# Altium schematic sheet main_board.SchDoc
size A4; SheetNumber: 1; SheetTotal: 1
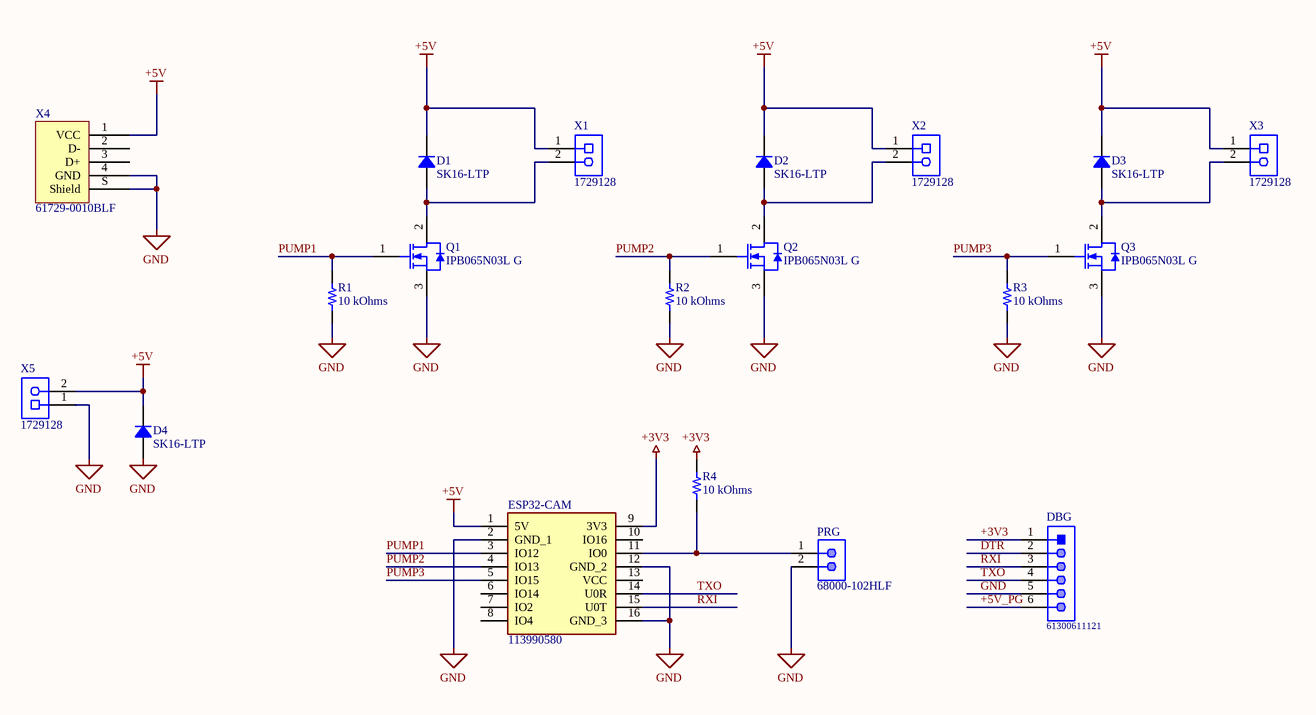
[diagram p0: main_board.SchDoc]

## Parts
D1  SK16-LTP  [DO214AA SMB]
D2  SK16-LTP  [DO214AA SMB]
D3  SK16-LTP  [DO214AA SMB]
D4  SK16-LTP  [DO214AA SMB]
DBG  61300611121  [61300611121]
ESP32-CAM  113990580  [113990580]
PRG  68000-102HLF  [AMPH-68000-102HLF_V]
Q1  IPB065N03L G  [INF-PG-TO-263-3-2_A_L]
Q2  IPB065N03L G  [INF-PG-TO-263-3-2_A_L]
Q3  IPB065N03L G  [INF-PG-TO-263-3-2_A_L]
R1  10 kOhms  [RES 1206_3216]
R2  10 kOhms  [RES 1206_3216]
R3  10 kOhms  [RES 1206_3216]
R4  10 kOhms  [RES 1206_3216]
X1  1729128  [PHOE-1729128-2_V]
X2  1729128  [PHOE-1729128-2_V]
X3  1729128  [PHOE-1729128-2_V]
X4  61729-0010BLF  [FCI USB 61729-0010BLF]
X5  1729128  [PHOE-1729128-2_V]

## Nets
+3V3: DBG.1 ESP32-CAM.9(3V3) R4.1
+5V: D1.2 D2.2 D3.2 D4.2 ESP32-CAM.1(5V) X1.1 X2.1 X3.1 X4.1(VCC) X5.2
GND: D4.1 DBG.5 ESP32-CAM.2(GND_1) ESP32-CAM.12(GND_2) ESP32-CAM.16(GND_3) PRG.2 Q1.3(SOURCE) Q2.3(SOURCE) Q3.3(SOURCE) R1.2 R2.2 R3.2 X4.4(GND) X4.S(Shield) X5.1
+5V_PG: DBG.6
DTR: DBG.2
PUMP1: ESP32-CAM.3(IO12) Q1.1(GATE) R1.1
PUMP2: ESP32-CAM.4(IO13) Q2.1(GATE) R2.1
PUMP3: ESP32-CAM.5(IO15) Q3.1(GATE) R3.1
RXI: DBG.3 ESP32-CAM.15(U0T)
TXO: DBG.4 ESP32-CAM.14(U0R)
NetD1_1: D1.1 Q1.2(DRAIN) X1.2
NetD2_1: D2.1 Q2.2(DRAIN) X2.2
NetD3_1: D3.1 Q3.2(DRAIN) X3.2
NetESP32-CAM_11: ESP32-CAM.11(IO0) PRG.1 R4.2

Not connected (* = marked no-connect by the designer): ESP32-CAM 6(IO14) 7(IO2) 8(IO4) 10(IO16) 13(VCC); X4 2(D-) 3(D+)

## Library data of the parts
D1-D4 = SK16-LTP: DIODE SCHOTTKY 60V 1A DO214AA; Manufacturer: Micro Commercial Co; Current - Reverse Leakage @ Vr: 500µA @ 60V; Speed: Fast Recovery =< 500ns, > 200mA (Io); Voltage - Forward (Vf) (Max) @ If: 720mV @ 1A; Part Number: SK16-LTP; ComponentLink1Description: Datasheet; ComponentLink1URL: https://www.mccsemi.com/pdf/Products/SK12-L~SK110-L(DO-214AA)-V1.pdf; ComponentLink2Description: DigiKey Link; ComponentLink2URL: http://digikey.com/product-detail/en/micro-commercial-co/SK16-LTP/SK16-LTPMSCT-ND/2642064; Current - Average Rectified (Io): 1A; Diode Type: Schottky; LastUpdated: 2.9.2020. 01:18:51; Lifecycle Status: Active; Minimum Order: 1; Mounting Type: Surface Mount; Operating Temperature - Junction: -55°C ~ 125°C; Package / Case: DO-214AA, SMB; Packaging: TapeAndReel; PartId: 1607; Part Status: Active; Price: 0.07; Series: -; Supplier 1: DigiKey; Supplier Part Number 1: SK16-LTPMSCT-ND; Supplier Device Package: DO-214AA (SMB); Voltage - DC Reverse (Vr) (Max): 60V
DBG = CMP-1502-01070-1: THT Vertical Pin Header WR-PHD, Pitch 2.54 mm, Single Row, 6 pins; Manufacturer: Wurth Elektronik; Gender: Male; Pin Number: 6; Pitch: 2.54mm; Working Voltage: 250VAC; Rated Current: 3A; Withstanding Voltage: 500VAC; Contact Resistance: 20mOhm; Operating Temperature: -40to105degC; Packaging: Bag; Datasheet URL: https://katalog.we-online.de/em/datasheet/6130xx11121.pdf; Package Reference: 61300611121; Mounting Technology: THT; Publisher: WurthElektronik; Part Number: 61300611121; Manufacturer URL: http://www.we-online.de; Row Number: Single; Orientation: Vertical
ESP32-CAM = 113990580: Integrated Circuit; Manufacturer_Name: Seeed Studio; Datasheet Link: https://github.com/SeeedDocument/Outsourcing/raw/master/113990580%20ESP32-CAM/113990580%20ESP32-CAM%20Product%20Specification.pdf; Height: 3mm; Manufacturer_Part_Number: 113990580; Mouser Part Number: 713-113990580; Mouser Price/Stock: https://www.mouser.com/Search/Refine.aspx?Keyword=713-113990580; Arrow Part Number: 113990580; Arrow Price/Stock: https://www.arrow.com/en/products/113990580/seeed-technology-limited
PRG = CMP-2000-05666-1: Male Header, Pitch 2.54 mm, 1 x 2 Position, Height 8.38 mm, Tail Length 2.41 mm, RoHS, Bulk; Number of Positions: 2; Insulation Resistance: 5000MOhms; Voltage Rating: 1.5kV; Mounting Angle: Vertical; Pitch: 2.54mm; Brand: FCI; Current Rating: 3A; Mating Post Length: 5.84mm; Operating Temperature Range: -65Cto+125C; Product Category: Headers&WireHousings; Datasheet URL: https://datasheet.ciiva.com/5149/68000-274228-5149165.pdf; Number of Positions / Contacts: 2; Contact Gender: Pin(Male); Packaging: Bulk; Mounting Technology: ThroughHole; Product Type: Headers; Housing Material: Thermoplastic; Contact Material: PhosphorBronze; Contact Plating: Gold/GTX; Package Description: Male Header, Pitch 2.54 mm, 1 x 2 Position, Height 8.38 mm, Tail Length 2.41 mm; Package Reference: 68000-102HLF; Type: Unshrouded; Factory Pack Quantity: 100; Termination Style: ThroughHole; RoHS: Details; Series: 68000; Mounting Style: ThroughHole; Flammability Rating: UL94V-0; Number of Rows: 1; Manufacturer: FCI; Termination Post Length: 2.41mm; Manufacturer URL: http://www.amphenol.com/; Datasheet Version: Rev. F, 04/2006
Q1-Q3 = CMP-1090-00112-1: N-Channel OptiMOS 3 Power-Transistor, 30 V VDS, 50 A ID, -55 to 175 degC, PG-TO-263-3-2, Reel, Green; Manufacturer: Infineon; IDpuls (max): 350Â A; RDS (on) (max): 6.5Â mOhm; Ptot (max): 56Â W; Rth: 2.7Â K/W; Polarity: N; VGS(th) (max): 2.2Â V; Green: TRUE; VGS(th) (min): 1Â V; ID (max): 50Â A; RthJA (max): 62Â K/W; QG: 23Â nC; VDS (max): 30Â V; RDS (on) (max) (@4.5V): 9.5Â mOhm; PackageReference: PG-TO-263-3-2; DatasheetVersion: Rev. 2.0; Mounting Technology: Surface Mount; ComponentLink2Description: Datasheet; PartNumber: IPB065N03L G; ComponentLink1Description: Manufacturer URL; Halogen-free: TRUE; RthJC (max): 2.7Â K/W; Packing: Reel; ComponentLink3Description: Package Specification; ComponentLink2URL: http://www.infineon.com/dgdl/IPP065N03L_rev2.pdf?folderId=db3a30431441fb5d01148c401f250e27&fileId=db3a30431441fb5d011492371ebc0fe2; PackageDescription: 3-Pin Plastic (Green) Transistor Single Outline Package, 10.06 x 8.98 mm Body, 2.54 mm Pitch; PackageVersion: Rev. 01, 08/2007; ComponentLink1URL: http://www.infineon.com/; ComponentLink3URL: http://www.infineon.com/dgdl/IPB026N06N_Rev2.2.pdf?folderId=db3a304313b8b5a60113cee8763b02d7&fileId=db3a3043372d5cc8013754c7b2a74f7c
R1-R4 = CRG1206F10K: RES SMD 10K OHM 1% 1/4W 1206; Manufacturer: TE Connectivity Passive Product; Power (Watts): 0.25W, 1/4W; Temperature Coefficient: ±100ppm/°C; Part Number: CRG1206F10K; ComponentLink1Description: Datasheet; ComponentLink1URL: https://www.te.com/commerce/DocumentDelivery/DDEController?Action=srchrtrv&DocNm=1773204&DocType=DS&DocLang=English; ComponentLink2Description: DigiKey Link; ComponentLink2URL: http://digikey.com/product-detail/en/te-connectivity-passive-product/CRG1206F10K/A106069CT-ND/3477720; Composition: Thick Film; Device Package: 1206 (3216 Metric); Height - Seated (Max): 0.026" (0.65mm); LastUpdated: 2.9.2020. 01:13:10; Lifecycle Status: Active; Minimum Order: 1; Number of Terminations: 2; Operating Temperature: -55°C ~ 155°C; Package / Case: 1206 (3216 Metric); Packaging: TapeAndReel; PartId: 26989; Part Status: Active; Price: 0.01; Resistance: 10 kOhms; Series: CRG, Neohm; Size / Dimension: 0.122" L x 0.061" W (3.10mm x 1.55mm); Supplier 1: DigiKey; Supplier Part Number 1: A106069CT-ND; Supplier Device Package: 1206; Tolerance: ±1%; Value: 10 kOhms
X1-X3 X5 = CMP-2000-05815-1: PCB Terminal Block, 13.5 A, 400 V, 2-Pin THD, RoHS, Bulk; Manufacturer: Phoenix Contact; Package Version: 03/2015; No. of Rows: 1; Pitch: 5.08mm; No. of Positions: 2; Voltage Rating: 400V; Current Rating: 13500mA; Manufacturer URL: http://www.phoenixcontact.com/; Datasheet URL: https://datasheet.ciiva.com/16046/1729128-16046181.pdf; RoHS: TRUE; Package URL: https://www.phoenixcontact.com/online/portal/pi/pxc/product_detail_page/!ut/p/b1/3VdJjqNKFDxLH8AFycySyWY2ozFsEPOMMQaDOX1XedGL_1Vdm5YXJleknhSKeBkvI6EA8ncAo3AYoDhBQGco6KN7VURTdemj9us_IEKEZo_YHiPAEWEFmDGOHMORkqKYCORBZxgL7ZoaZYcbFFUZ3fqxSY6GOuxydWUuHqz1ynmMFygu583Bob0Ewr6Sd_l-5m-kAueHiB0jpRwZwe58wwtkpxtMYd_LmGcDRU02dRNEyWt6Y2ti5pSyJ_reIkzIulrqApdnbT11V5jnCKbYNCvhEM1MCpPByat_X379-iThf08CI5GfOPqfBeS3BRoBOdD55AKVv0iLwCMq-2BrzXWSGRH7pUGD9uwXQjiph3xL0DKQwdGa0JImiIOmBNOestqgwTHSSs2oOep-78apyXQBvNi8ZLaFjvjWvcaUEBu0MC6Wbe-d6mB0FAebo2lUWinqYaZs5DAYzV0RP9yitUjnGJ0iI9xhZkT42OCQNUJJhkgWINNQLP2JFP6OpMg3JCVg70jqHT0lvKOnhHf0lPuOnnLf0VPuWx6_dxwUIvwk5WMkT0kLL1mh61l2yZVSzG3pYV_bqo-mj6uMKwKwdnnW8Jh5RTOJzMOA5c-eJDaZQw4mTMPH02PvS_ZAqNVjVTo2WyYLkwH_KU1mmmG5kjRhDqPXLwwVHvVOjCM60-fpXvTDfMGW1PVFVS1r4e4yVDk4ZdNbkUHvqPqQSeian4UD39fNKmachqdJ1NJbyk8rXT9mXTvPk3oE5meulKGgiruPJek-4I9hTT6G8ZLOyRSm2RRVbThERQad5OS28hdt4YW4vG0stgYYzsWsK4_7y6DZMjJSCqri1kyiZR5vD7pwIrNR7QwPHTcLTI5qT7eRlpHrdGiupYlqQDJ7zy_CND8fWWBoLRXxk1RVcXiBQwbTD4Xi7KL-FuO94t9xaqweXzH; PartNumber: 1729128; Package Description: 2-Pin Through Hole Device, Body 8.1 x 10.16 mm, Pitch 5.08 mm; Datasheet Version: 12/2013; Mounting Technology: ThroughHole; Orientation: Horizontal; Package Reference: 1729128-2; Packing: Bulk
X4 = 61729-0010BLF: CONN RCPT USB2.0 TYPEB 4POS R/A; Manufacturer: Amphenol ICC (FCI); Connector Type: USB - B; Current Rating (Amps): 1A; Gender: Receptacle; Mating Cycles: 1500; Number of Contacts: 4; Number of Ports: 1; Shielding: Shielded; Part Number: 61729-0010BLF; ComponentLink1Description: Datasheet; ComponentLink1URL: http://www.amphenol-icc.com/media/wysiwyg/files/drawing/61729.pdf; ComponentLink2Description: DigiKey Link; ComponentLink2URL: //digikey.com/product-detail/en/amphenol-icc-fci/61729-0010BLF/609-1039-ND/1001353; Features: Board Lock; LastUpdated: 9.12.2019. 20:53:17; Lifecycle Status: 0; Minimum Order: 1; Mounting Feature: Horizontal; Mounting Type: Through Hole, Right Angle; Operating Temperature: -55°C ~ 85°C; Packaging: Tube; Part Status: Active; Price: 0.99; Series: 61729; Specifications: USB 2.0; Supplier 1: DigiKey; Supplier Part Number 1: 609-1039-ND; Termination: Solder